# EAGLE design moduleduino (EAGLE 6.5.0)
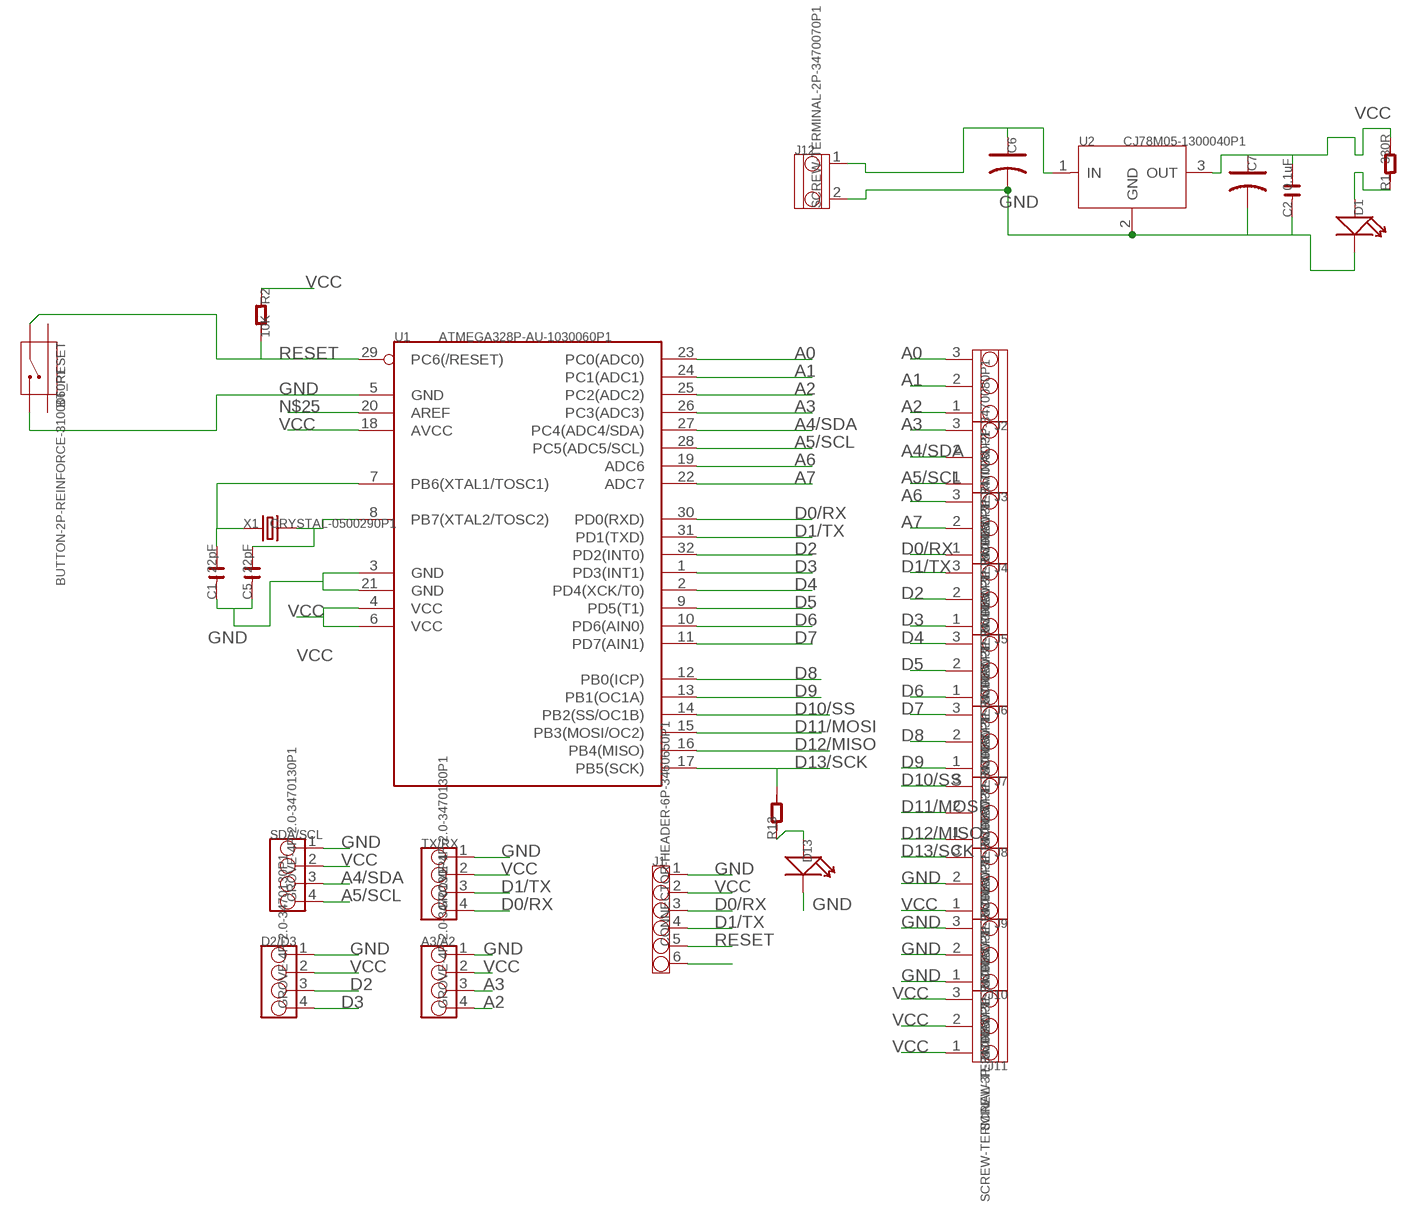
[diagram p0: schematic, sheet 1]

## Parts
A3/A2  GROVE-4P-2.0-3470130P1  [4P-2.0]
BT_RESET  BUTTON-2P-REINFORCE-3100060P1  [4P-SMD-7.0X3.5X3.5H-90D]
C1  22pF  C-0603  [C0603]
C2  0.1uF  C-0603  [C0603]
C5  22pF  C-0603  [C0603]
C6  C-POLAR-B  [AVX-B]
C7  C-POLAR-B  [AVX-B]
D1  LED  [LED0603]
D2/D3  GROVE-4P-2.0-3470130P1  [4P-2.0]
D13  LED  [LED0603]
J1  CONNECTOR-HEADER-6P-3460650P1  [1X6P-2.54-2.54-11.6-3.0-BLACK-MALE]
J2  SCREW-TERMINAL-3P-3470080P1  [3P-5.0]
J3  SCREW-TERMINAL-3P-3470080P1  [3P-5.0]
J4  SCREW-TERMINAL-3P-3470080P1  [3P-5.0]
J5  SCREW-TERMINAL-3P-3470080P1  [3P-5.0]
J6  SCREW-TERMINAL-3P-3470080P1  [3P-5.0]
J7  SCREW-TERMINAL-3P-3470080P1  [3P-5.0]
J8  SCREW-TERMINAL-3P-3470080P1  [3P-5.0]
J9  SCREW-TERMINAL-3P-3470080P1  [3P-5.0]
J10  SCREW-TERMINAL-3P-3470080P1  [3P-5.0]
J11  SCREW-TERMINAL-3P-3470080P1  [3P-5.0]
J12  SCREW-TERMINAL-2P-3470070P1  [2P-3.5]
R1  330R  R-0603  [R0603]
R2  10K  R-0603  [R0603]
R13  R-0603  [R0603]
SDA/SCL  GROVE-4P-2.0-3470130P1  [4P-2.0]
TX/RX  GROVE-4P-2.0-3470130P1  [4P-2.0]
U1  ATMEGA328P-AU-1030060P1  [TQFP32]
U2  CJ78M05-1300040P1  [TO252]
X1  CRYSTAL-0500290P1  [2P-SMD-5.0X3.2]

## Nets
A0: J2.3 U1.23(PC0(ADC0))
A1: J2.2 U1.24(PC1(ADC1))
A2: A3/A2.4 J2.1 U1.25(PC2(ADC2))
A3: A3/A2.3 J3.3 U1.26(PC3(ADC3))
A4/SDA: J3.2 SDA/SCL.3 U1.27(PC4(ADC4/SDA))
A5/SCL: J3.1 SDA/SCL.4 U1.28(PC5(ADC5/SCL))
A6: J4.3 U1.19(ADC6)
A7: J4.2 U1.22(ADC7)
D0/RX: J1.3 J4.1 TX/RX.4 U1.30(PD0(RXD))
D1/TX: J1.4 J5.3 TX/RX.3 U1.31(PD1(TXD))
D2: D2/D3.3 J5.2 U1.32(PD2(INT0))
D3: D2/D3.4 J5.1 U1.1(PD3(INT1))
D4: J6.3 U1.2(PD4(XCK/T0))
D5: J6.2 U1.9(PD5(T1))
D6: J6.1 U1.10(PD6(AIN0))
D7: J7.3 U1.11(PD7(AIN1))
D8: J7.2 U1.12(PB0(ICP))
D9: J7.1 U1.13(PB1(OC1A))
D10/SS: J8.3 U1.14(PB2(SS/OC1B))
D11/MOSI: J8.2 U1.15(PB3(MOSI/OC2))
D12/MISO: J8.1 U1.16(PB4(MISO))
D13/SCK: J9.3 R13.2 U1.17(PB5(SCK))
GND: A3/A2.1 BT_RESET.2 C1.1 C2.1 C5.1 C6.- C7.- D1.- D2/D3.1 D13.- J1.1 J9.2 J10.1 J10.2 J10.3 J12.2 SDA/SCL.1 TX/RX.1 U1.3(GND) U1.5(GND) U1.21(GND) U2.2(GND)
N$3: D13.+ R13.1
N$6: J1.6
N$25: U1.20(AREF)
N$27: C1.2 U1.7(PB6(XTAL1/TOSC1)) X1.1
N$28: C5.2 U1.8(PB7(XTAL2/TOSC2)) X1.2
N$32: C6.+ J12.1 U2.1(IN)
N$33: D1.+ R1.1
RESET: BT_RESET.1 J1.5 R2.2 U1.29(PC6(/RESET))
VCC: A3/A2.2 C2.2 C7.+ D2/D3.2 J1.2 J9.1 J11.1 J11.2 J11.3 R1.2 R2.1 SDA/SCL.2 TX/RX.2 U1.4(VCC) U1.6(VCC) U1.18(AVCC) U2.3(OUT)
Unconnected: BT_RESET.S1 BT_RESET.S2

## Library data of the parts
A3/A2 D2/D3 SDA/SCL TX/RX = OPL Eagle Library:GROVE-4P-2.0
BT_RESET = OPL Eagle Library:BUTTON-2P-REINFORCE: TS-1188E http://www.best-dz.com/?thread-374-2.html SMD Button
C1 C2 C5 = OPL Eagle Library:C*
C6 C7 = OPL Eagle Library:C-POLAR*
D1 D13 = OPL Eagle Library:LED*: LED
J1 = OPL Eagle Library:CONNECTOR-HEADER-6P
J2-J11 = OPL Eagle Library:SCREW-TERMINAL-3P
J12 = OPL Eagle Library:SCREW-TERMINAL-2P
R1 R2 R13 = OPL Eagle Library:R*
U1 = OPL Eagle Library:ATMEGA328P-AU: 8-bit AVR Microcontroller with 32K Bytes In-System Programmable Flash
U2 = OPL Eagle Library:CJ78M05: 0.5A Three Terminal Positive Voltage Regulators
X1 = OPL Eagle Library:CRYSTAL*

## Board
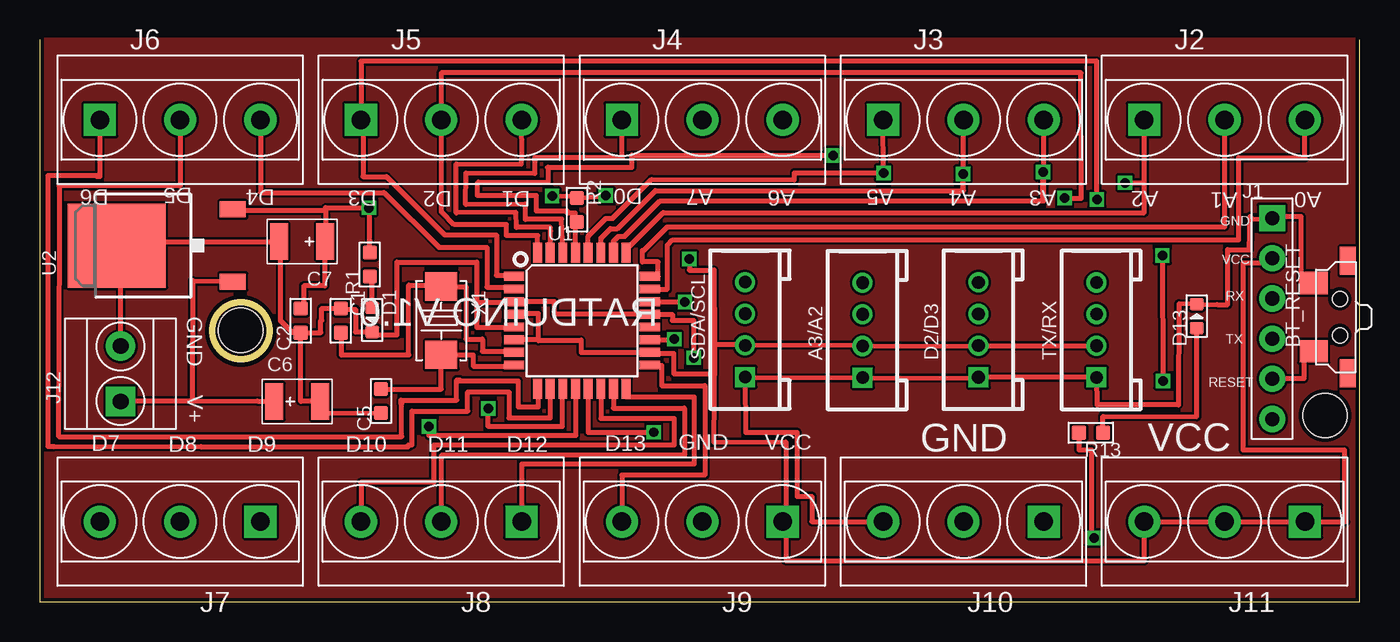
[diagram p1: board, top side]
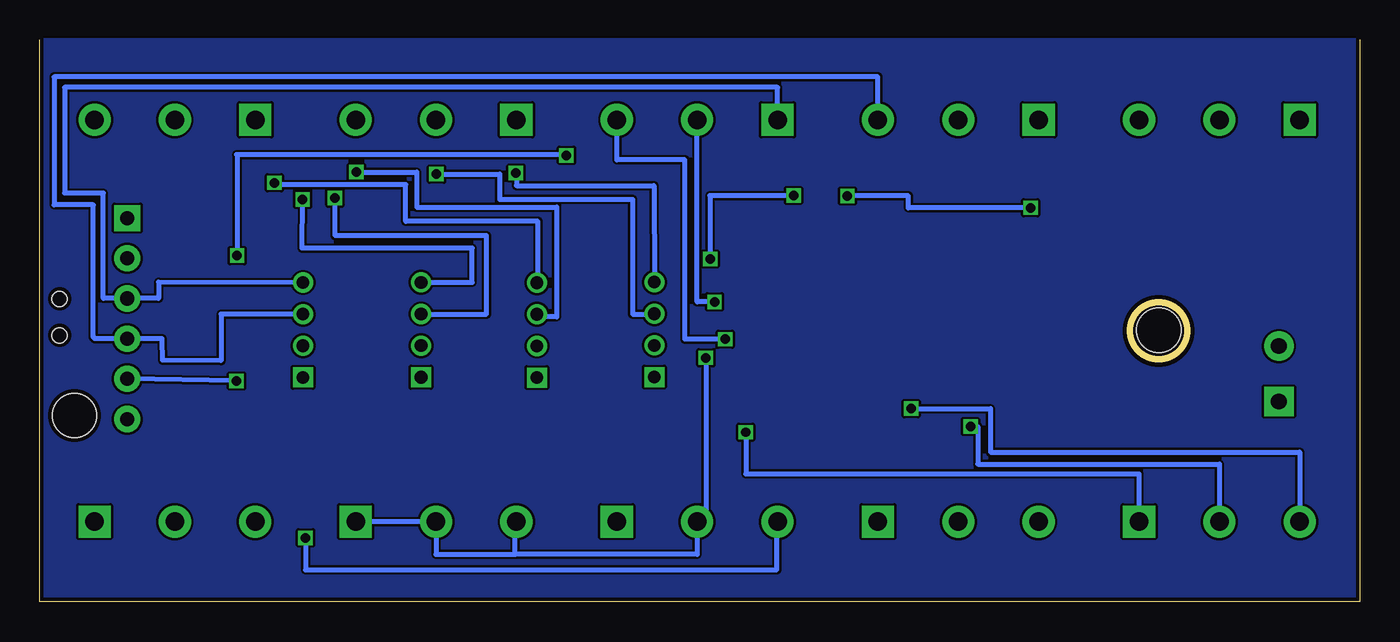
[diagram p2: board, bottom side, seen from below]

Size 83.49 x 35.55 mm. Coordinates in mm from the lower left corner, seen from the top.
Outline: 83.49,35.55 83.49,0 0,0 0,35.55
Outline: circle at 12.73,17.14 radius 1.8
Copper layers (1*2*15*16): Top 0.035mm / dielectric 0.2mm / layer 2 0.0175mm / dielectric 1.1mm / layer 15 0.0175mm / dielectric 0.2mm / Bottom 0.035mm
Design rules "SeeedStudio_DRU_no_angle_20130527": minimum track width 6mil, minimum drill 12mil, track to track 6mil, track to pad 6mil, pad to pad 6mil, via to via 6mil, smd to smd 0mil, copper to edge 10mil, drill to drill 10mil, minimum pad ring 6mil, minimum via ring 6mil, stop-mask expansion 2mil, vias tented up to drill 25mil, thermal gap 10mil
Holes 2.8 mm at 12.73,17.17 81.28,11.79

### Footprints (pad centres in the part's own frame; a part is rotated, then mirrored left to right if it is on the bottom)
4P-2.0 = drill 0.8 pad 1.27 square: 1 -3,0 | drill 0.8 pad 1.27: 2 -1,0; 3 1,0; 4 3,0
4P-SMD-7.0X3.5X3.5H-90D = smd 1.397 x 1.778: 1 -2.159,1.651; 2 2.159,1.651 | smd 1.778 x 1.016: S1 -3.556,-0.508; S2 3.556,-0.508 | hole 0.95: -1.15,0; 1.15,0
C0603 = smd 0.889 x 0.889: 1 -0.762,0; 2 0.762,0
AVX-B = smd 1.143 x 2.286: + -1.46,0; - 1.46,0
LED0603 = smd 0.762 x 0.889: + -0.762,0; - 0.762,0
1X6P-2.54-2.54-11.6-3.0-BLACK-MALE = drill 0.889 pad 1.651 square: 1 0,6.35 | drill 0.889 pad 1.651: 2 0,3.81; 3 0,1.27; 4 0,-1.27; 5 0,-3.81; 6 0,-6.35
3P-5.0 = drill 1.168 pad 2.032 square: 1 -5.08,0 | drill 1.168 pad 2.032: 2 0,0; 3 5.08,0
2P-3.5 = drill 1 pad 1.85 square: 1 -1.75,0 | drill 1 pad 1.85: 2 1.75,0
R0603 = smd 0.889 x 0.889: 1 -0.762,0; 2 0.762,0
TQFP32 = smd 1.27 x 0.559: 1 -4.293,2.8; 2 -4.293,2; 3 -4.293,1.2; 4 -4.293,0.4; 5 -4.293,-0.4; 6 -4.293,-1.2; 7 -4.293,-2; 8 -4.293,-2.8; 17 4.293,-2.8; 18 4.293,-2; 19 4.293,-1.2; 20 4.293,-0.4; 21 4.293,0.4; 22 4.293,1.2; 23 4.293,2; 24 4.293,2.8 | smd 0.559 x 1.27: 9 -2.8,-4.293; 10 -2,-4.293; 11 -1.2,-4.293; 12 -0.4,-4.293; 13 0.4,-4.293; 14 1.2,-4.293; 15 2,-4.293; 16 2.8,-4.293; 25 2.8,4.293; 26 2,4.293; 27 1.2,4.293; 28 0.4,4.293; 29 -0.4,4.293; 30 -1.2,4.293; 31 -2,4.293; 32 -2.8,4.293
TO252 = smd 1.016 x 1.651: 1 -2.286,-4.826; 3 2.286,-4.826 | smd 5.3 x 6.2: 2 0,2.5
2P-SMD-5.0X3.2 = smd 1.778 x 2.032: 1 -2.159,0; 2 2.159,0

### Placement (x,y rotation side)
A3/A2  52.04,17.18 90 top
BT_RESET  82.22,18.01 90 top
C1  19.05,17.78 270 top
C2  16.51,17.78 90 top
C5  21.59,12.7 90 top
C6  16.29,12.67 0 top
C7  16.61,22.79 180 top
D1  21.03,17.83 270 top
D2/D3  59.37,17.2 90 top
D13  73.16,18.07 90 top
J1  77.94,17.91 0 top
J2  74.93,30.48 0 top
J3  58.42,30.48 0 top
J4  41.91,30.48 0 top
J5  25.4,30.48 0 top
J6  8.89,30.48 0 top
J7  8.89,5.08 180 top
J8  25.4,5.08 180 top
J9  41.91,5.08 180 top
J10  58.42,5.08 180 top
J11  74.93,5.08 180 top
J12  5.12,14.43 90 top
R1  20.88,21.33 90 top
R2  33.98,24.79 270 top
R13  66.48,10.7 180 top
SDA/SCL  44.62,17.22 90 top
TX/RX  66.83,17.19 90 top
U1  34.29,17.78 0 top
U2  7.39,22.53 90 top
X1  25.4,17.78 270 top

### Tracks (layer width: path | path; a pad name or v marks a point on that pad's centre or on a via)
A0
  Top 0.305: U1.23 39.69,19.78 39.69,22.55 40.03,22.89 75.82,22.89 75.82,28.08 80.01,28.08 J2.3
A1
  Top 0.305: U1.24 39.11,20.58 39.11,21.5 38.13,21.5 38.13,22.23 38.21,22.23 39.69,23.71 74.93,23.71 J2.2
A2  (via drill 0.6)
  Top 0.305: U1.25 37.09,22.26 39.43,24.61 69.85,24.61 69.85,26.49 | 69.85,26.49 J2.1 | v68.64,26.49 69.85,26.49
  Bottom 0.305: A3/A2.4 51.98,20.16 51.98,24.05 60.33,24.05 60.33,26.39 68.64,26.39 v68.64,26.49
A3  (via drill 0.6)
  Top 0.305: U1.26 36.29,22.79 36.6,23.11 36.99,23.11 39.24,25.36 63.46,25.36 | J3.3 63.5,25.36 63.46,25.36 | 63.46,25.36 v63.46,27.18
  Bottom 0.305: v63.46,27.18 59.63,27.18 59.63,24.95 50.79,24.95 50.79,18.01 52.11,18.01 A3/A2.3
A4/SDA  (via drill 0.6)
  Top 0.305: U1.27 35.49,23 36.09,23.6 36.54,23.6 38.94,26 58.39,26 | J3.2 58.42,26 58.39,26 | 58.39,26 v58.39,27.04
  Bottom 0.305: v58.39,27.04 54.39,27.04 54.39,25.44 45.99,25.44 45.99,18.19 44.64,18.19 SDA/SCL.3
A5/SCL  (via drill 0.6)
  Top 0.305: U1.28 34.69,23.12 35.81,24.24 36.24,24.24 38.7,26.71 47.73,26.68 47.73,27.12 v53.37,27.12 J3.1
  Bottom 0.305: v53.37,27.12 53.34,26.32 44.64,26.32 SDA/SCL.4
A6  (via drill 0.6)
  Top 0.305: U1.19 40.13,16.58 v40.13,16.61
  Bottom 0.305: v40.13,16.61 42.68,16.61 42.68,27.95 46.99,27.95 J4.3
A7  (via drill 0.6)
  Top 0.305: U1.22 v40.81,18.97
  Bottom 0.305: v40.81,18.97 41.91,18.97 J4.2
D0/RX
  Top 0.305: U1.30 33.02,24.2 30.72,24.19 30.73,25.16 26.95,25.11 26.96,27.12 31.33,27.1 31.32,28.11 36.84,28.1 J4.1
  Bottom 0.305: J4.1 36.83,32.52 81.9,32.52 81.9,25.84 79.46,25.84 79.46,19.18 J1.3 75.97,19.18 75.97,20.21 TX/RX.4
D1/TX
  Top 0.305: U1.31 32.31,23.45 32.31,23.68 30.16,23.68 30.12,24.62 26.35,24.6 26.35,27.69 30.46,27.67 30.5,28.11 J5.3
  Bottom 0.305: J5.3 30.48,33.19 82.56,33.19 82.56,25.1 80.09,25.1 80.09,16.72 80.01,16.72 80.01,16.64 J1.4 75.74,16.64 75.74,16.57 75.71,15.28 72.01,15.26 72.01,18.19 TX/RX.3
D2  (via drill 0.6)
  Top 0.305: U1.32 31.5,23.16 29.52,23.16 29.52,23.85 26.21,23.85 25.41,24.65 25.41,30.47 J5.2 25.4,33.44 65.86,33.44 65.87,25.52 v64.81,25.53
  Bottom 0.305: D2/D3.3 55.23,18.2 55.23,23.15 64.79,23.15 v64.81,25.53
D3  (via drill 0.6)
  Top 0.305: U1.1 30,20.65 28.88,20.65 28.88,23.21 25.63,23.21 21.95,26.89 20.45,26.89 20.45,30.48 J5.1 20.32,34.18 66.84,34.18 66.84,25.57 v66.86,25.45
  Bottom 0.305: D2/D3.4 56.14,20.2 56.14,22.37 66.89,22.37 v66.86,25.45
D4
  Top 0.305: J6.3 13.97,25.88 21.78,25.88 25.25,22.41 28.3,22.41 28.3,19.9 30,19.9 U1.2
D5
  Top 0.305: J6.2 8.89,26.29 1.24,26.31 1.23,13.66 1.23,10.46 22.9,10.46 22.9,12.54 22.85,12.54 22.85,12.75 26.37,12.75 26.37,14.03 26.59,14.03 26.59,13.98 30.27,13.98 30.27,12.33 31.55,12.33 31.55,13.49 U1.9
D6
  Top 0.305: J6.1 3.81,26.89 3.63,26.89 3.63,26.95 0.53,26.95 0.53,9.82 0.91,9.82 8.32,9.84 10.2,9.82 23.33,9.82 23.33,9.93 23.54,9.93 23.54,12.06 27.07,12.06 27.07,13.29 29.68,13.29 29.68,11.63 32.3,11.63 U1.10
D7  (via drill 0.6)
  Top 0.305: U1.11 33.05,13.49 33.05,11.09 28.38,11.09 v28.38,12.22
  Bottom 0.305: v28.38,12.22 23.36,12.22 23.36,9.47 3.81,9.47 J7.3
D8  (via drill 0.6)
  Top 0.305: U1.12 33.9,13.49 33.9,10.52 24.62,10.52 v24.62,11.09
  Bottom 0.305: v24.62,11.09 24.16,11.09 24.16,8.72 8.89,8.72 J7.2
D9  (via drill 0.6)
  Top 0.305: U1.13 34.69,10.73 v38.84,10.73
  Bottom 0.305: v38.84,10.73 38.84,8.1 13.97,8.1 J7.1
D10/SS
  Top 0.305: U1.14 35.49,11.61 40.13,11.61 40.13,9.91 24.92,9.91 24.92,7.57 20.32,7.57 J8.3
D11/MOSI
  Top 0.305: U1.15 36.29,12.26 40.78,12.26 40.78,9.26 25.4,9.26 J8.2
D12/MISO
  Top 0.305: U1.16 37.09,12.97 41.4,12.97 41.4,8.71 30.48,8.71 J8.1
D13/SCK  (via drill 0.6)
  Top 0.305: U1.17 38.58,14.96 39.34,14.96 39.34,13.68 42.07,13.68 42.07,8.01 36.83,8.01 J9.3 | R13.2 65.72,9.62 66.51,9.62 66.51,4.05 v66.67,4.05
  Bottom 0.305: v66.67,4.05 66.67,2.03 36.88,2.05 36.88,5.08 J9.3
GND  (via drill 0.6)
  Top 0.305: C2.1 16.51,12.68 C6.- 17.78,11.95 C5.1 | C2.1 16,17.02 15.24,17.78 15.24,22.79 C7.- 5.52,22.79 | C2.1 17.78,17.02 17.78,17.78 17.85,17.78 17.85,18.55 19.05,18.55 C1.1 19.05,18.49 19.98,18.49 19.98,17.07 D1.- 21.03,16.89 22.6,16.89 22.6,21.49 27.64,21.49 27.64,18.92 | 27.64,18.92 27.64,17.35 27.76,17.35 27.76,17.38 U1.5 | 27.64,18.92 30,18.92 U1.3 32.56,18.98 32.56,18.18 U1.21 40.02,18.18 40.02,17.8 41.36,17.8 v41.36,15.44 | J10.3 48.82,5.08 48.82,6.67 47.9,6.67 47.9,10.71 44.64,10.71 SDA/SCL.1 44.64,14.16 A3/A2.1 59.37,14.16 D2/D3.1 TX/RX.1 66.85,14.19 66.88,12.46 72.02,12.46 72.04,18.84 D13.- 74.47,18.8 75.13,18.79 75.13,22.27 75.11,22.25 76.5,22.25 76.55,24.38 76.68,24.2 J1.1 | J12.2 5.12,20.84 5.52,20.84 5.52,22.79 | U2.2 5.52,22.99 5.52,22.79 | 77.94,24.21 J1.1 | BT_RESET.2 79.77,20.16 79.77,24.36 77.94,24.36 J1.1
  Bottom 0.305: v41.36,15.44 41.36,5.08 J9.2 41.91,3.02 53.42,3.02 | 53.42,3.02 53.42,5.08 J10.3 | 53.42,3.02 58.42,3.02 J10.2 J10.1
N$1
  pour Bottom: 0.09,35.47 83.44,35.47 83.44,0.07 0.09,0.07 0.09,35.47
N$2
  pour Top: 0.08,35.53 83.31,35.53 83.31,0.31 0.09,0.31 0.09,35.52
N$3
  Top 0.305: R13.1 67.24,11.73 73.16,11.72 73.17,12.67 D13.+
N$27
  Top 0.305: C1.2 19.08,17.02 19.08,15.62 23.34,15.62 23.34,20.04 25.4,20.04 X1.1 26.96,19.94 26.96,16.61 28.01,16.61 28.01,15.84 30,15.84 U1.7
N$28
  Top 0.305: C5.2 25.4,13.46 X1.2 27.42,15.62 27.42,14.91 30,14.91 U1.8
N$32
  Top 0.305: 13.78,12.7 C6.+ 9.65,12.71 | U2.1 9.73,20.28 9.69,20.31 9.65,12.71 | J12.1 5.12,12.71 9.65,12.71
N$33
  Top 0.305: D1.+ 21.03,20.57 R1.1
RESET  (via drill 0.6)
  Top 0.305: R2.2 33.89,23.92 U1.29 33.89,24.15 33.89,24.58 33.37,24.58 33.37,24.71 31.43,24.71 31.43,25.69 27.7,25.69 27.7,26.49 27.73,26.49 27.73,26.55 32.17,26.55 32.17,27.47 | 32.17,27.47 32.12,27.47 | 32.17,27.47 37.45,27.47 37.45,28.25 v50.17,28.23 | v71,21.89 v71.03,13.97 | BT_RESET.1 79.95,15.85 79.95,14.12 77.94,14.12 J1.5
  Bottom 0.305: v50.17,28.23 50.18,28.26 71.03,28.28 71,28.28 v71,21.89 | v71.03,13.97 J1.5
VCC  (via drill 0.6)
  Top 0.305: 20.88,22.86 R1.2 20.88,24.92 v20.82,24.92 20.82,24.93 18.09,24.93 18.09,24.76 | C2.2 16.7,18.54 16.7,19.97 18.03,19.97 18.03,22.79 C7.+ 18.09,22.79 18.09,24.76 | U1.4 30,18.25 31.53,18.25 31.53,16.52 31.56,16.52 31.56,16.55 | 31.56,16.55 31.56,16.58 U1.6 | 31.56,16.55 34.24,16.55 34.24,15.78 U1.18 38.58,15.71 40.1,15.71 40.1,14.43 42.69,14.43 42.69,14.54 42.67,15.74 | 42.67,15.74 42.63,10.1 47.18,10.13 47.18,5.08 | 47.18,5.08 J9.1 | v35.81,25.69 33.95,25.53 R2.1 34.05,25.66 v32.41,25.66 | v41.09,21.68 41.09,20.97 42.66,20.97 42.69,16.26 | 42.69,16.26 42.69,15.83 42.67,15.74 | 47.18,5.08 47.2,5.08 47.2,2.59 69.85,2.59 J11.3 J11.2 J11.1 82.53,5.07 | 42.69,16.26 44.64,16.26 SDA/SCL.2 52.11,16.27 A3/A2.2 59.37,16.16 D2/D3.2 66.87,16.2 TX/RX.2 | U2.3 12.27,24.76 18.09,24.76 | 82.58,5.07 82.53,5.07 | 82.53,5.07 82.53,9.6 76.11,9.6 76.11,21.43 77.94,21.43 J1.2
  Bottom 0.305: v35.81,25.69 41.11,25.68 v41.09,21.68 | v20.82,24.92 28.56,24.92 28.56,25.66 v32.41,25.66

### Text on the board
tPlace: RATDUINO V1.0
tNames: D6 | D5 | D4 | D3 | D2 | D1 | D0 | A7 | A6 | A5 | A4 | A3 | A2 | A1 | A0 | GND | VCC | RX | GND | TX | RESET | V+ | D7 | D13 | GND | VCC | GND | VCC | D8 | D9 | D10 | D11 | D12